# Altium schematic sheet STM32F103C8T6核心板_2020-09-11_10-37-49.schdoc
size 62 x 81 mm
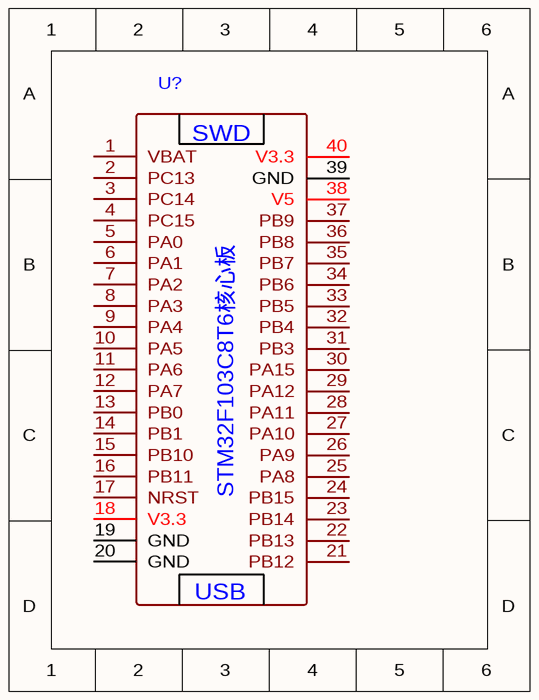
[diagram p0: STM32F103C8T6核心板_2020-09-11_10-37-49.schdoc]

## Parts
U?  (no value)  [STM32F103C8T6核心板]

## Nets

Not connected (* = marked no-connect by the designer): U? 1(VBAT) 2(PC13) 3(PC14) 4(PC15) 5(PA0) 6(PA1) 7(PA2) 8(PA3) 9(PA4) 10(PA5) 11(PA6) 12(PA7) 13(PB0) 14(PB1) 15(PB10) 16(PB11) 17(NRST) 18(V3.3) 19(GND) 20(GND) 21(PB12) 22(PB13) 23(PB14) 24(PB15) 25(PA8) 26(PA9) 27(PA10) 28(PA11) 29(PA12) 30(PA15) 31(PB3) 32(PB4) 33(PB5) 34(PB6) 35(PB7) 36(PB8) 37(PB9) 38(V5) 39(GND) 40(V3.3)

## Notes on the sheet
- (in symbol STM32F103C8T6核心板) SWD; USB

## Library data of the parts
U? = STM32F103C8T6核心板